# Altium project volumetric-display-boards.PrjPcb (part 1 of 2)
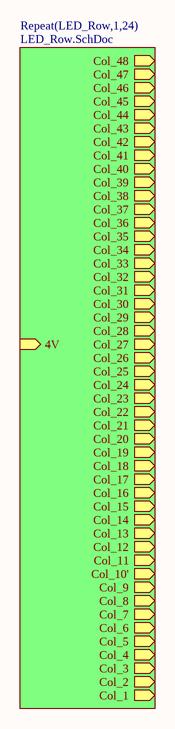
[diagram p0: LED_Matrix.SchDoc]
2 sheets, 384 parts. Net scope: hierarchical (ports join the sheet entries above them; power ports are global).
Board file: LED_Matrix.PcbDoc
Sheets:
  LED_Matrix.SchDoc
    LED_Row1 = LED_Row.SchDoc
    LED_Row2 = LED_Row.SchDoc
    LED_Row3 = LED_Row.SchDoc
    LED_Row4 = LED_Row.SchDoc
    LED_Row5 = LED_Row.SchDoc
    LED_Row6 = LED_Row.SchDoc
    LED_Row7 = LED_Row.SchDoc
    LED_Row8 = LED_Row.SchDoc
    LED_Row9 = LED_Row.SchDoc
    LED_Row10 = LED_Row.SchDoc
    LED_Row11 = LED_Row.SchDoc
    LED_Row12 = LED_Row.SchDoc
    LED_Row13 = LED_Row.SchDoc
    LED_Row14 = LED_Row.SchDoc
    LED_Row15 = LED_Row.SchDoc
    LED_Row16 = LED_Row.SchDoc
    LED_Row17 = LED_Row.SchDoc
    LED_Row18 = LED_Row.SchDoc
    LED_Row19 = LED_Row.SchDoc
    LED_Row20 = LED_Row.SchDoc
    LED_Row21 = LED_Row.SchDoc
    LED_Row22 = LED_Row.SchDoc
    LED_Row23 = LED_Row.SchDoc
    LED_Row24 = LED_Row.SchDoc

## Sheet LED_Matrix.SchDoc
size A; SheetNumber: 1; SheetTotal: 1

### Sub-sheets
Repeat(LED_Row,1,24) = LED_Row.SchDoc: Col_48 (out), Col_47 (out), Col_46 (out), Col_45 (out), Col_44 (out), Col_43 (out), Col_42 (out), Col_41 (out), Col_40 (out), Col_39 (out), Col_38 (out), Col_37 (out), Col_36 (out), Col_35 (out), Col_34 (out), Col_33 (out), Col_32 (out), Col_31 (out), Col_30 (out), Col_29 (out), Col_28 (out), Col_27 (out), Col_26 (out), Col_25 (out), Col_24 (out), Col_23 (out), Col_22 (out), Col_21 (out), Col_20 (out), Col_19 (out), Col_18 (out), Col_17 (out), Col_16 (out), Col_15 (out), Col_14 (out), Col_13 (out), Col_12 (out), Col_11 (out), Col_10' (out), Col_9 (out), Col_8 (out), Col_7 (out), Col_6 (out), Col_5 (out), Col_4 (out), Col_3 (out), Col_2 (out), Col_1 (out), 4V (in)

## Sheet LED_Row.SchDoc
size 549 x 199 mm; SheetNumber: 2; SheetTotal: 2
Used 24 times, as channels LED_Row1, LED_Row2, LED_Row3, LED_Row4, LED_Row5, LED_Row6, LED_Row7, LED_Row8, LED_Row9, LED_Row10, LED_Row11, LED_Row12, LED_Row13, LED_Row14, LED_Row15, LED_Row16, LED_Row17, LED_Row18, LED_Row19, LED_Row20, LED_Row21, LED_Row22, LED_Row23, LED_Row24. Parts and nets are listed once, with the designators drawn on the sheet.
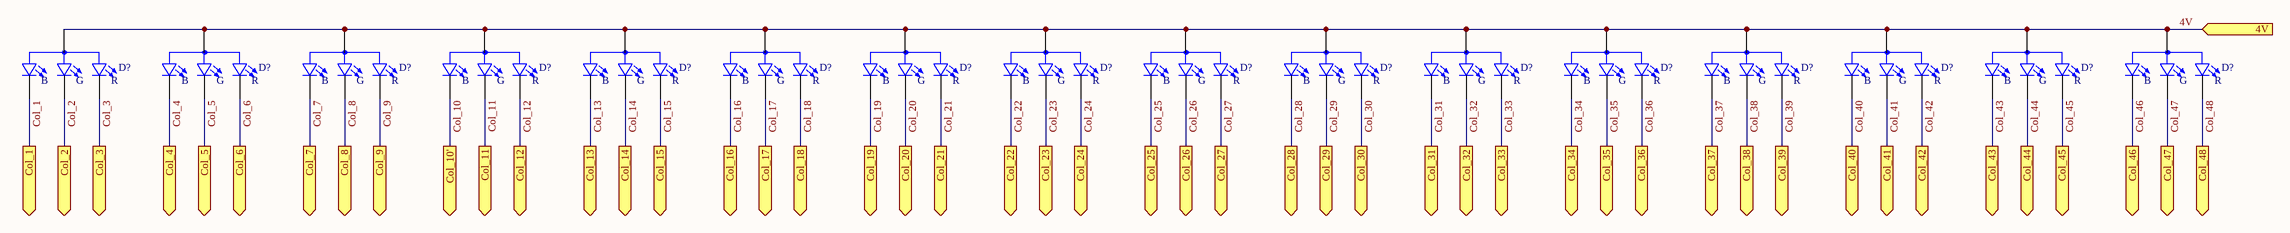
[diagram p1: LED_Row.SchDoc]

### Parts
(Parts that share a designator on the sheet are numbered #1, #2 ... from top to bottom, then left to right.)
D?#1  LED-RGB-0000  [LED-RGB-0000]  (value not drawn)
D?#2  LED-RGB-0000  [LED-RGB-0000]  (value not drawn)
D?#3  LED-RGB-0000  [LED-RGB-0000]  (value not drawn)
D?#4  LED-RGB-0000  [LED-RGB-0000]  (value not drawn)
D?#5  LED-RGB-0000  [LED-RGB-0000]  (value not drawn)
D?#6  LED-RGB-0000  [LED-RGB-0000]  (value not drawn)
D?#7  LED-RGB-0000  [LED-RGB-0000]  (value not drawn)
D?#8  LED-RGB-0000  [LED-RGB-0000]  (value not drawn)
D?#9  LED-RGB-0000  [LED-RGB-0000]  (value not drawn)
D?#10  LED-RGB-0000  [LED-RGB-0000]  (value not drawn)
D?#11  LED-RGB-0000  [LED-RGB-0000]  (value not drawn)
D?#12  LED-RGB-0000  [LED-RGB-0000]  (value not drawn)
D?#13  LED-RGB-0000  [LED-RGB-0000]  (value not drawn)
D?#14  LED-RGB-0000  [LED-RGB-0000]  (value not drawn)
D?#15  LED-RGB-0000  [LED-RGB-0000]  (value not drawn)
D?#16  LED-RGB-0000  [LED-RGB-0000]  (value not drawn)

### Ports
4V (in), Col_1 (out), Col_2 (out), Col_3 (out), Col_4 (out), Col_5 (out), Col_6 (out), Col_7 (out), Col_8 (out), Col_9 (out), Col_10' (out), Col_11 (out), Col_12 (out), Col_13 (out), Col_14 (out), Col_15 (out), Col_16 (out), Col_17 (out), Col_18 (out), Col_19 (out), Col_20 (out), Col_21 (out), Col_22 (out), Col_23 (out), Col_24 (out), Col_25 (out), Col_26 (out), Col_27 (out), Col_28 (out), Col_29 (out), Col_30 (out), Col_31 (out), Col_32 (out), Col_33 (out), Col_34 (out), Col_35 (out), Col_36 (out), Col_37 (out), Col_38 (out), Col_39 (out), Col_40 (out), Col_41 (out), Col_42 (out), Col_43 (out), Col_44 (out), Col_45 (out), Col_46 (out), Col_47 (out), Col_48 (out)

### Nets
4V: D?#1.3(A) D?#2.3(A) D?#3.3(A) D?#4.3(A) D?#5.3(A) D?#6.3(A) D?#7.3(A) D?#8.3(A) D?#9.3(A) D?#10.3(A) D?#11.3(A) D?#12.3(A) D?#13.3(A) D?#14.3(A) D?#15.3(A) D?#16.3(A) ; port 4V
Col_1: D?#1.2(B_C) ; port Col_1
Col_2: D?#1.1(G_C) ; port Col_2
Col_3: D?#1.4(R_C) ; port Col_3
Col_4: D?#2.2(B_C) ; port Col_4
Col_5: D?#2.1(G_C) ; port Col_5
Col_6: D?#2.4(R_C) ; port Col_6
Col_7: D?#3.2(B_C) ; port Col_7
Col_8: D?#3.1(G_C) ; port Col_8
Col_9: D?#3.4(R_C) ; port Col_9
Col_10: D?#4.2(B_C) ; port Col_10'
Col_11: D?#4.1(G_C) ; port Col_11
Col_12: D?#4.4(R_C) ; port Col_12
Col_13: D?#5.2(B_C) ; port Col_13
Col_14: D?#5.1(G_C) ; port Col_14
Col_15: D?#5.4(R_C) ; port Col_15
Col_16: D?#6.2(B_C) ; port Col_16
Col_17: D?#6.1(G_C) ; port Col_17
Col_18: D?#6.4(R_C) ; port Col_18
Col_19: D?#7.2(B_C) ; port Col_19
Col_20: D?#7.1(G_C) ; port Col_20
Col_21: D?#7.4(R_C) ; port Col_21
Col_22: D?#8.2(B_C) ; port Col_22
Col_23: D?#8.1(G_C) ; port Col_23
Col_24: D?#8.4(R_C) ; port Col_24
Col_25: D?#9.2(B_C) ; port Col_25
Col_26: D?#9.1(G_C) ; port Col_26
Col_27: D?#9.4(R_C) ; port Col_27
Col_28: D?#10.2(B_C) ; port Col_28
Col_29: D?#10.1(G_C) ; port Col_29
Col_30: D?#10.4(R_C) ; port Col_30
Col_31: D?#11.2(B_C) ; port Col_31
Col_32: D?#11.1(G_C) ; port Col_32
Col_33: D?#11.4(R_C) ; port Col_33
Col_34: D?#12.2(B_C) ; port Col_34
Col_35: D?#12.1(G_C) ; port Col_35
Col_36: D?#12.4(R_C) ; port Col_36
Col_37: D?#13.2(B_C) ; port Col_37
Col_38: D?#13.1(G_C) ; port Col_38
Col_39: D?#13.4(R_C) ; port Col_39
Col_40: D?#14.2(B_C) ; port Col_40
Col_41: D?#14.1(G_C) ; port Col_41
Col_42: D?#14.4(R_C) ; port Col_42
Col_43: D?#15.2(B_C) ; port Col_43
Col_44: D?#15.1(G_C) ; port Col_44
Col_45: D?#15.4(R_C) ; port Col_45
Col_46: D?#16.2(B_C) ; port Col_46
Col_47: D?#16.1(G_C) ; port Col_47
Col_48: D?#16.4(R_C) ; port Col_48

### Channels
LED_Row1: designators D?=D1_LED_Row1 D?=D2_LED_Row1 D?=D3_LED_Row1 D?=D4_LED_Row1 D?=D5_LED_Row1 D?=D6_LED_Row1 D?=D7_LED_Row1 D?=D8_LED_Row1 D?=D9_LED_Row1 D?=D10_LED_Row1 D?=D11_LED_Row1 D?=D12_LED_Row1 D?=D13_LED_Row1 D?=D14_LED_Row1 D?=D15_LED_Row1 D?=D16_LED_Row1; ports 4V=4V Col_1=Col_1 Col_2=Col_2 Col_3=Col_3 Col_4=Col_4 Col_5=Col_5 Col_6=Col_6 Col_7=Col_7 Col_8=Col_8 Col_9=Col_9 Col_10'=Col_10 Col_11=Col_11 Col_12=Col_12 Col_13=Col_13 Col_14=Col_14 Col_15=Col_15 Col_16=Col_16 Col_17=Col_17 Col_18=Col_18 Col_19=Col_19 Col_20=Col_20 Col_21=Col_21 Col_22=Col_22 Col_23=Col_23 Col_24=Col_24 Col_25=Col_25 Col_26=Col_26 Col_27=Col_27 Col_28=Col_28 Col_29=Col_29 Col_30=Col_30 Col_31=Col_31 Col_32=Col_32 Col_33=Col_33 Col_34=Col_34 Col_35=Col_35 Col_36=Col_36 Col_37=Col_37 Col_38=Col_38 Col_39=Col_39 Col_40=Col_40 Col_41=Col_41 Col_42=Col_42 Col_43=Col_43 Col_44=Col_44 Col_45=Col_45 Col_46=Col_46 Col_47=Col_47 Col_48=Col_48
LED_Row2: designators D?=D1_LED_Row2 D?=D2_LED_Row2 D?=D3_LED_Row2 D?=D4_LED_Row2 D?=D5_LED_Row2 D?=D6_LED_Row2 D?=D7_LED_Row2 D?=D8_LED_Row2 D?=D9_LED_Row2 D?=D10_LED_Row2 D?=D11_LED_Row2 D?=D12_LED_Row2 D?=D13_LED_Row2 D?=D14_LED_Row2 D?=D15_LED_Row2 D?=D16_LED_Row2; ports 4V=4V Col_1=Col_1 Col_2=Col_2 Col_3=Col_3 Col_4=Col_4 Col_5=Col_5 Col_6=Col_6 Col_7=Col_7 Col_8=Col_8 Col_9=Col_9 Col_10'=Col_10 Col_11=Col_11 Col_12=Col_12 Col_13=Col_13 Col_14=Col_14 Col_15=Col_15 Col_16=Col_16 Col_17=Col_17 Col_18=Col_18 Col_19=Col_19 Col_20=Col_20 Col_21=Col_21 Col_22=Col_22 Col_23=Col_23 Col_24=Col_24 Col_25=Col_25 Col_26=Col_26 Col_27=Col_27 Col_28=Col_28 Col_29=Col_29 Col_30=Col_30 Col_31=Col_31 Col_32=Col_32 Col_33=Col_33 Col_34=Col_34 Col_35=Col_35 Col_36=Col_36 Col_37=Col_37 Col_38=Col_38 Col_39=Col_39 Col_40=Col_40 Col_41=Col_41 Col_42=Col_42 Col_43=Col_43 Col_44=Col_44 Col_45=Col_45 Col_46=Col_46 Col_47=Col_47 Col_48=Col_48
LED_Row3: designators D?=D1_LED_Row3 D?=D2_LED_Row3 D?=D3_LED_Row3 D?=D4_LED_Row3 D?=D5_LED_Row3 D?=D6_LED_Row3 D?=D7_LED_Row3 D?=D8_LED_Row3 D?=D9_LED_Row3 D?=D10_LED_Row3 D?=D11_LED_Row3 D?=D12_LED_Row3 D?=D13_LED_Row3 D?=D14_LED_Row3 D?=D15_LED_Row3 D?=D16_LED_Row3; ports 4V=4V Col_1=Col_1 Col_2=Col_2 Col_3=Col_3 Col_4=Col_4 Col_5=Col_5 Col_6=Col_6 Col_7=Col_7 Col_8=Col_8 Col_9=Col_9 Col_10'=Col_10 Col_11=Col_11 Col_12=Col_12 Col_13=Col_13 Col_14=Col_14 Col_15=Col_15 Col_16=Col_16 Col_17=Col_17 Col_18=Col_18 Col_19=Col_19 Col_20=Col_20 Col_21=Col_21 Col_22=Col_22 Col_23=Col_23 Col_24=Col_24 Col_25=Col_25 Col_26=Col_26 Col_27=Col_27 Col_28=Col_28 Col_29=Col_29 Col_30=Col_30 Col_31=Col_31 Col_32=Col_32 Col_33=Col_33 Col_34=Col_34 Col_35=Col_35 Col_36=Col_36 Col_37=Col_37 Col_38=Col_38 Col_39=Col_39 Col_40=Col_40 Col_41=Col_41 Col_42=Col_42 Col_43=Col_43 Col_44=Col_44 Col_45=Col_45 Col_46=Col_46 Col_47=Col_47 Col_48=Col_48
LED_Row4: designators D?=D1_LED_Row4 D?=D2_LED_Row4 D?=D3_LED_Row4 D?=D4_LED_Row4 D?=D5_LED_Row4 D?=D6_LED_Row4 D?=D7_LED_Row4 D?=D8_LED_Row4 D?=D9_LED_Row4 D?=D10_LED_Row4 D?=D11_LED_Row4 D?=D12_LED_Row4 D?=D13_LED_Row4 D?=D14_LED_Row4 D?=D15_LED_Row4 D?=D16_LED_Row4; ports 4V=4V Col_1=Col_1 Col_2=Col_2 Col_3=Col_3 Col_4=Col_4 Col_5=Col_5 Col_6=Col_6 Col_7=Col_7 Col_8=Col_8 Col_9=Col_9 Col_10'=Col_10 Col_11=Col_11 Col_12=Col_12 Col_13=Col_13 Col_14=Col_14 Col_15=Col_15 Col_16=Col_16 Col_17=Col_17 Col_18=Col_18 Col_19=Col_19 Col_20=Col_20 Col_21=Col_21 Col_22=Col_22 Col_23=Col_23 Col_24=Col_24 Col_25=Col_25 Col_26=Col_26 Col_27=Col_27 Col_28=Col_28 Col_29=Col_29 Col_30=Col_30 Col_31=Col_31 Col_32=Col_32 Col_33=Col_33 Col_34=Col_34 Col_35=Col_35 Col_36=Col_36 Col_37=Col_37 Col_38=Col_38 Col_39=Col_39 Col_40=Col_40 Col_41=Col_41 Col_42=Col_42 Col_43=Col_43 Col_44=Col_44 Col_45=Col_45 Col_46=Col_46 Col_47=Col_47 Col_48=Col_48
LED_Row5: designators D?=D1_LED_Row5 D?=D2_LED_Row5 D?=D3_LED_Row5 D?=D4_LED_Row5 D?=D5_LED_Row5 D?=D6_LED_Row5 D?=D7_LED_Row5 D?=D8_LED_Row5 D?=D9_LED_Row5 D?=D10_LED_Row5 D?=D11_LED_Row5 D?=D12_LED_Row5 D?=D13_LED_Row5 D?=D14_LED_Row5 D?=D15_LED_Row5 D?=D16_LED_Row5; ports 4V=4V Col_1=Col_1 Col_2=Col_2 Col_3=Col_3 Col_4=Col_4 Col_5=Col_5 Col_6=Col_6 Col_7=Col_7 Col_8=Col_8 Col_9=Col_9 Col_10'=Col_10 Col_11=Col_11 Col_12=Col_12 Col_13=Col_13 Col_14=Col_14 Col_15=Col_15 Col_16=Col_16 Col_17=Col_17 Col_18=Col_18 Col_19=Col_19 Col_20=Col_20 Col_21=Col_21 Col_22=Col_22 Col_23=Col_23 Col_24=Col_24 Col_25=Col_25 Col_26=Col_26 Col_27=Col_27 Col_28=Col_28 Col_29=Col_29 Col_30=Col_30 Col_31=Col_31 Col_32=Col_32 Col_33=Col_33 Col_34=Col_34 Col_35=Col_35 Col_36=Col_36 Col_37=Col_37 Col_38=Col_38 Col_39=Col_39 Col_40=Col_40 Col_41=Col_41 Col_42=Col_42 Col_43=Col_43 Col_44=Col_44 Col_45=Col_45 Col_46=Col_46 Col_47=Col_47 Col_48=Col_48
LED_Row6: designators D?=D1_LED_Row6 D?=D2_LED_Row6 D?=D3_LED_Row6 D?=D4_LED_Row6 D?=D5_LED_Row6 D?=D6_LED_Row6 D?=D7_LED_Row6 D?=D8_LED_Row6 D?=D9_LED_Row6 D?=D10_LED_Row6 D?=D11_LED_Row6 D?=D12_LED_Row6 D?=D13_LED_Row6 D?=D14_LED_Row6 D?=D15_LED_Row6 D?=D16_LED_Row6; ports 4V=4V Col_1=Col_1 Col_2=Col_2 Col_3=Col_3 Col_4=Col_4 Col_5=Col_5 Col_6=Col_6 Col_7=Col_7 Col_8=Col_8 Col_9=Col_9 Col_10'=Col_10 Col_11=Col_11 Col_12=Col_12 Col_13=Col_13 Col_14=Col_14 Col_15=Col_15 Col_16=Col_16 Col_17=Col_17 Col_18=Col_18 Col_19=Col_19 Col_20=Col_20 Col_21=Col_21 Col_22=Col_22 Col_23=Col_23 Col_24=Col_24 Col_25=Col_25 Col_26=Col_26 Col_27=Col_27 Col_28=Col_28 Col_29=Col_29 Col_30=Col_30 Col_31=Col_31 Col_32=Col_32 Col_33=Col_33 Col_34=Col_34 Col_35=Col_35 Col_36=Col_36 Col_37=Col_37 Col_38=Col_38 Col_39=Col_39 Col_40=Col_40 Col_41=Col_41 Col_42=Col_42 Col_43=Col_43 Col_44=Col_44 Col_45=Col_45 Col_46=Col_46 Col_47=Col_47 Col_48=Col_48
LED_Row7: designators D?=D1_LED_Row7 D?=D2_LED_Row7 D?=D3_LED_Row7 D?=D4_LED_Row7 D?=D5_LED_Row7 D?=D6_LED_Row7 D?=D7_LED_Row7 D?=D8_LED_Row7 D?=D9_LED_Row7 D?=D10_LED_Row7 D?=D11_LED_Row7 D?=D12_LED_Row7 D?=D13_LED_Row7 D?=D14_LED_Row7 D?=D15_LED_Row7 D?=D16_LED_Row7; ports 4V=4V Col_1=Col_1 Col_2=Col_2 Col_3=Col_3 Col_4=Col_4 Col_5=Col_5 Col_6=Col_6 Col_7=Col_7 Col_8=Col_8 Col_9=Col_9 Col_10'=Col_10 Col_11=Col_11 Col_12=Col_12 Col_13=Col_13 Col_14=Col_14 Col_15=Col_15 Col_16=Col_16 Col_17=Col_17 Col_18=Col_18 Col_19=Col_19 Col_20=Col_20 Col_21=Col_21 Col_22=Col_22 Col_23=Col_23 Col_24=Col_24 Col_25=Col_25 Col_26=Col_26 Col_27=Col_27 Col_28=Col_28 Col_29=Col_29 Col_30=Col_30 Col_31=Col_31 Col_32=Col_32 Col_33=Col_33 Col_34=Col_34 Col_35=Col_35 Col_36=Col_36 Col_37=Col_37 Col_38=Col_38 Col_39=Col_39 Col_40=Col_40 Col_41=Col_41 Col_42=Col_42 Col_43=Col_43 Col_44=Col_44 Col_45=Col_45 Col_46=Col_46 Col_47=Col_47 Col_48=Col_48
LED_Row8: designators D?=D1_LED_Row8 D?=D2_LED_Row8 D?=D3_LED_Row8 D?=D4_LED_Row8 D?=D5_LED_Row8 D?=D6_LED_Row8 D?=D7_LED_Row8 D?=D8_LED_Row8 D?=D9_LED_Row8 D?=D10_LED_Row8 D?=D11_LED_Row8 D?=D12_LED_Row8 D?=D13_LED_Row8 D?=D14_LED_Row8 D?=D15_LED_Row8 D?=D16_LED_Row8; ports 4V=4V Col_1=Col_1 Col_2=Col_2 Col_3=Col_3 Col_4=Col_4 Col_5=Col_5 Col_6=Col_6 Col_7=Col_7 Col_8=Col_8 Col_9=Col_9 Col_10'=Col_10 Col_11=Col_11 Col_12=Col_12 Col_13=Col_13 Col_14=Col_14 Col_15=Col_15 Col_16=Col_16 Col_17=Col_17 Col_18=Col_18 Col_19=Col_19 Col_20=Col_20 Col_21=Col_21 Col_22=Col_22 Col_23=Col_23 Col_24=Col_24 Col_25=Col_25 Col_26=Col_26 Col_27=Col_27 Col_28=Col_28 Col_29=Col_29 Col_30=Col_30 Col_31=Col_31 Col_32=Col_32 Col_33=Col_33 Col_34=Col_34 Col_35=Col_35 Col_36=Col_36 Col_37=Col_37 Col_38=Col_38 Col_39=Col_39 Col_40=Col_40 Col_41=Col_41 Col_42=Col_42 Col_43=Col_43 Col_44=Col_44 Col_45=Col_45 Col_46=Col_46 Col_47=Col_47 Col_48=Col_48
LED_Row9: designators D?=D1_LED_Row9 D?=D2_LED_Row9 D?=D3_LED_Row9 D?=D4_LED_Row9 D?=D5_LED_Row9 D?=D6_LED_Row9 D?=D7_LED_Row9 D?=D8_LED_Row9 D?=D9_LED_Row9 D?=D10_LED_Row9 D?=D11_LED_Row9 D?=D12_LED_Row9 D?=D13_LED_Row9 D?=D14_LED_Row9 D?=D15_LED_Row9 D?=D16_LED_Row9; ports 4V=4V Col_1=Col_1 Col_2=Col_2 Col_3=Col_3 Col_4=Col_4 Col_5=Col_5 Col_6=Col_6 Col_7=Col_7 Col_8=Col_8 Col_9=Col_9 Col_10'=Col_10 Col_11=Col_11 Col_12=Col_12 Col_13=Col_13 Col_14=Col_14 Col_15=Col_15 Col_16=Col_16 Col_17=Col_17 Col_18=Col_18 Col_19=Col_19 Col_20=Col_20 Col_21=Col_21 Col_22=Col_22 Col_23=Col_23 Col_24=Col_24 Col_25=Col_25 Col_26=Col_26 Col_27=Col_27 Col_28=Col_28 Col_29=Col_29 Col_30=Col_30 Col_31=Col_31 Col_32=Col_32 Col_33=Col_33 Col_34=Col_34 Col_35=Col_35 Col_36=Col_36 Col_37=Col_37 Col_38=Col_38 Col_39=Col_39 Col_40=Col_40 Col_41=Col_41 Col_42=Col_42 Col_43=Col_43 Col_44=Col_44 Col_45=Col_45 Col_46=Col_46 Col_47=Col_47 Col_48=Col_48
LED_Row10: designators D?=D1_LED_Row10 D?=D2_LED_Row10 D?=D3_LED_Row10 D?=D4_LED_Row10 D?=D5_LED_Row10 D?=D6_LED_Row10 D?=D7_LED_Row10 D?=D8_LED_Row10 D?=D9_LED_Row10 D?=D10_LED_Row10 D?=D11_LED_Row10 D?=D12_LED_Row10 D?=D13_LED_Row10 D?=D14_LED_Row10 D?=D15_LED_Row10 D?=D16_LED_Row10; ports 4V=4V Col_1=Col_1 Col_2=Col_2 Col_3=Col_3 Col_4=Col_4 Col_5=Col_5 Col_6=Col_6 Col_7=Col_7 Col_8=Col_8 Col_9=Col_9 Col_10'=Col_10 Col_11=Col_11 Col_12=Col_12 Col_13=Col_13 Col_14=Col_14 Col_15=Col_15 Col_16=Col_16 Col_17=Col_17 Col_18=Col_18 Col_19=Col_19 Col_20=Col_20 Col_21=Col_21 Col_22=Col_22 Col_23=Col_23 Col_24=Col_24 Col_25=Col_25 Col_26=Col_26 Col_27=Col_27 Col_28=Col_28 Col_29=Col_29 Col_30=Col_30 Col_31=Col_31 Col_32=Col_32 Col_33=Col_33 Col_34=Col_34 Col_35=Col_35 Col_36=Col_36 Col_37=Col_37 Col_38=Col_38 Col_39=Col_39 Col_40=Col_40 Col_41=Col_41 Col_42=Col_42 Col_43=Col_43 Col_44=Col_44 Col_45=Col_45 Col_46=Col_46 Col_47=Col_47 Col_48=Col_48
LED_Row11: designators D?=D1_LED_Row11 D?=D2_LED_Row11 D?=D3_LED_Row11 D?=D4_LED_Row11 D?=D5_LED_Row11 D?=D6_LED_Row11 D?=D7_LED_Row11 D?=D8_LED_Row11 D?=D9_LED_Row11 D?=D10_LED_Row11 D?=D11_LED_Row11 D?=D12_LED_Row11 D?=D13_LED_Row11 D?=D14_LED_Row11 D?=D15_LED_Row11 D?=D16_LED_Row11; ports 4V=4V Col_1=Col_1 Col_2=Col_2 Col_3=Col_3 Col_4=Col_4 Col_5=Col_5 Col_6=Col_6 Col_7=Col_7 Col_8=Col_8 Col_9=Col_9 Col_10'=Col_10 Col_11=Col_11 Col_12=Col_12 Col_13=Col_13 Col_14=Col_14 Col_15=Col_15 Col_16=Col_16 Col_17=Col_17 Col_18=Col_18 Col_19=Col_19 Col_20=Col_20 Col_21=Col_21 Col_22=Col_22 Col_23=Col_23 Col_24=Col_24 Col_25=Col_25 Col_26=Col_26 Col_27=Col_27 Col_28=Col_28 Col_29=Col_29 Col_30=Col_30 Col_31=Col_31 Col_32=Col_32 Col_33=Col_33 Col_34=Col_34 Col_35=Col_35 Col_36=Col_36 Col_37=Col_37 Col_38=Col_38 Col_39=Col_39 Col_40=Col_40 Col_41=Col_41 Col_42=Col_42 Col_43=Col_43 Col_44=Col_44 Col_45=Col_45 Col_46=Col_46 Col_47=Col_47 Col_48=Col_48
LED_Row12: designators D?=D1_LED_Row12 D?=D2_LED_Row12 D?=D3_LED_Row12 D?=D4_LED_Row12 D?=D5_LED_Row12 D?=D6_LED_Row12 D?=D7_LED_Row12 D?=D8_LED_Row12 D?=D9_LED_Row12 D?=D10_LED_Row12 D?=D11_LED_Row12 D?=D12_LED_Row12 D?=D13_LED_Row12 D?=D14_LED_Row12 D?=D15_LED_Row12 D?=D16_LED_Row12; ports 4V=4V Col_1=Col_1 Col_2=Col_2 Col_3=Col_3 Col_4=Col_4 Col_5=Col_5 Col_6=Col_6 Col_7=Col_7 Col_8=Col_8 Col_9=Col_9 Col_10'=Col_10 Col_11=Col_11 Col_12=Col_12 Col_13=Col_13 Col_14=Col_14 Col_15=Col_15 Col_16=Col_16 Col_17=Col_17 Col_18=Col_18 Col_19=Col_19 Col_20=Col_20 Col_21=Col_21 Col_22=Col_22 Col_23=Col_23 Col_24=Col_24 Col_25=Col_25 Col_26=Col_26 Col_27=Col_27 Col_28=Col_28 Col_29=Col_29 Col_30=Col_30 Col_31=Col_31 Col_32=Col_32 Col_33=Col_33 Col_34=Col_34 Col_35=Col_35 Col_36=Col_36 Col_37=Col_37 Col_38=Col_38 Col_39=Col_39 Col_40=Col_40 Col_41=Col_41 Col_42=Col_42 Col_43=Col_43 Col_44=Col_44 Col_45=Col_45 Col_46=Col_46 Col_47=Col_47 Col_48=Col_48
LED_Row13: designators D?=D1_LED_Row13 D?=D2_LED_Row13 D?=D3_LED_Row13 D?=D4_LED_Row13 D?=D5_LED_Row13 D?=D6_LED_Row13 D?=D7_LED_Row13 D?=D8_LED_Row13 D?=D9_LED_Row13 D?=D10_LED_Row13 D?=D11_LED_Row13 D?=D12_LED_Row13 D?=D13_LED_Row13 D?=D14_LED_Row13 D?=D15_LED_Row13 D?=D16_LED_Row13; ports 4V=4V Col_1=Col_1 Col_2=Col_2 Col_3=Col_3 Col_4=Col_4 Col_5=Col_5 Col_6=Col_6 Col_7=Col_7 Col_8=Col_8 Col_9=Col_9 Col_10'=Col_10 Col_11=Col_11 Col_12=Col_12 Col_13=Col_13 Col_14=Col_14 Col_15=Col_15 Col_16=Col_16 Col_17=Col_17 Col_18=Col_18 Col_19=Col_19 Col_20=Col_20 Col_21=Col_21 Col_22=Col_22 Col_23=Col_23 Col_24=Col_24 Col_25=Col_25 Col_26=Col_26 Col_27=Col_27 Col_28=Col_28 Col_29=Col_29 Col_30=Col_30 Col_31=Col_31 Col_32=Col_32 Col_33=Col_33 Col_34=Col_34 Col_35=Col_35 Col_36=Col_36 Col_37=Col_37 Col_38=Col_38 Col_39=Col_39 Col_40=Col_40 Col_41=Col_41 Col_42=Col_42 Col_43=Col_43 Col_44=Col_44 Col_45=Col_45 Col_46=Col_46 Col_47=Col_47 Col_48=Col_48
LED_Row14: designators D?=D1_LED_Row14 D?=D2_LED_Row14 D?=D3_LED_Row14 D?=D4_LED_Row14 D?=D5_LED_Row14 D?=D6_LED_Row14 D?=D7_LED_Row14 D?=D8_LED_Row14 D?=D9_LED_Row14 D?=D10_LED_Row14 D?=D11_LED_Row14 D?=D12_LED_Row14 D?=D13_LED_Row14 D?=D14_LED_Row14 D?=D15_LED_Row14 D?=D16_LED_Row14; ports 4V=4V Col_1=Col_1 Col_2=Col_2 Col_3=Col_3 Col_4=Col_4 Col_5=Col_5 Col_6=Col_6 Col_7=Col_7 Col_8=Col_8 Col_9=Col_9 Col_10'=Col_10 Col_11=Col_11 Col_12=Col_12 Col_13=Col_13 Col_14=Col_14 Col_15=Col_15 Col_16=Col_16 Col_17=Col_17 Col_18=Col_18 Col_19=Col_19 Col_20=Col_20 Col_21=Col_21 Col_22=Col_22 Col_23=Col_23 Col_24=Col_24 Col_25=Col_25 Col_26=Col_26 Col_27=Col_27 Col_28=Col_28 Col_29=Col_29 Col_30=Col_30 Col_31=Col_31 Col_32=Col_32 Col_33=Col_33 Col_34=Col_34 Col_35=Col_35 Col_36=Col_36 Col_37=Col_37 Col_38=Col_38 Col_39=Col_39 Col_40=Col_40 Col_41=Col_41 Col_42=Col_42 Col_43=Col_43 Col_44=Col_44 Col_45=Col_45 Col_46=Col_46 Col_47=Col_47 Col_48=Col_48
LED_Row15: designators D?=D1_LED_Row15 D?=D2_LED_Row15 D?=D3_LED_Row15 D?=D4_LED_Row15 D?=D5_LED_Row15 D?=D6_LED_Row15 D?=D7_LED_Row15 D?=D8_LED_Row15 D?=D9_LED_Row15 D?=D10_LED_Row15 D?=D11_LED_Row15 D?=D12_LED_Row15 D?=D13_LED_Row15 D?=D14_LED_Row15 D?=D15_LED_Row15 D?=D16_LED_Row15; ports 4V=4V Col_1=Col_1 Col_2=Col_2 Col_3=Col_3 Col_4=Col_4 Col_5=Col_5 Col_6=Col_6 Col_7=Col_7 Col_8=Col_8 Col_9=Col_9 Col_10'=Col_10 Col_11=Col_11 Col_12=Col_12 Col_13=Col_13 Col_14=Col_14 Col_15=Col_15 Col_16=Col_16 Col_17=Col_17 Col_18=Col_18 Col_19=Col_19 Col_20=Col_20 Col_21=Col_21 Col_22=Col_22 Col_23=Col_23 Col_24=Col_24 Col_25=Col_25 Col_26=Col_26 Col_27=Col_27 Col_28=Col_28 Col_29=Col_29 Col_30=Col_30 Col_31=Col_31 Col_32=Col_32 Col_33=Col_33 Col_34=Col_34 Col_35=Col_35 Col_36=Col_36 Col_37=Col_37 Col_38=Col_38 Col_39=Col_39 Col_40=Col_40 Col_41=Col_41 Col_42=Col_42 Col_43=Col_43 Col_44=Col_44 Col_45=Col_45 Col_46=Col_46 Col_47=Col_47 Col_48=Col_48
LED_Row16: designators D?=D1_LED_Row16 D?=D2_LED_Row16 D?=D3_LED_Row16 D?=D4_LED_Row16 D?=D5_LED_Row16 D?=D6_LED_Row16 D?=D7_LED_Row16 D?=D8_LED_Row16 D?=D9_LED_Row16 D?=D10_LED_Row16 D?=D11_LED_Row16 D?=D12_LED_Row16 D?=D13_LED_Row16 D?=D14_LED_Row16 D?=D15_LED_Row16 D?=D16_LED_Row16; ports 4V=4V Col_1=Col_1 Col_2=Col_2 Col_3=Col_3 Col_4=Col_4 Col_5=Col_5 Col_6=Col_6 Col_7=Col_7 Col_8=Col_8 Col_9=Col_9 Col_10'=Col_10 Col_11=Col_11 Col_12=Col_12 Col_13=Col_13 Col_14=Col_14 Col_15=Col_15 Col_16=Col_16 Col_17=Col_17 Col_18=Col_18 Col_19=Col_19 Col_20=Col_20 Col_21=Col_21 Col_22=Col_22 Col_23=Col_23 Col_24=Col_24 Col_25=Col_25 Col_26=Col_26 Col_27=Col_27 Col_28=Col_28 Col_29=Col_29 Col_30=Col_30 Col_31=Col_31 Col_32=Col_32 Col_33=Col_33 Col_34=Col_34 Col_35=Col_35 Col_36=Col_36 Col_37=Col_37 Col_38=Col_38 Col_39=Col_39 Col_40=Col_40 Col_41=Col_41 Col_42=Col_42 Col_43=Col_43 Col_44=Col_44 Col_45=Col_45 Col_46=Col_46 Col_47=Col_47 Col_48=Col_48
LED_Row17: designators D?=D1_LED_Row17 D?=D2_LED_Row17 D?=D3_LED_Row17 D?=D4_LED_Row17 D?=D5_LED_Row17 D?=D6_LED_Row17 D?=D7_LED_Row17 D?=D8_LED_Row17 D?=D9_LED_Row17 D?=D10_LED_Row17 D?=D11_LED_Row17 D?=D12_LED_Row17 D?=D13_LED_Row17 D?=D14_LED_Row17 D?=D15_LED_Row17 D?=D16_LED_Row17; ports 4V=4V Col_1=Col_1 Col_2=Col_2 Col_3=Col_3 Col_4=Col_4 Col_5=Col_5 Col_6=Col_6 Col_7=Col_7 Col_8=Col_8 Col_9=Col_9 Col_10'=Col_10 Col_11=Col_11 Col_12=Col_12 Col_13=Col_13 Col_14=Col_14 Col_15=Col_15 Col_16=Col_16 Col_17=Col_17 Col_18=Col_18 Col_19=Col_19 Col_20=Col_20 Col_21=Col_21 Col_22=Col_22 Col_23=Col_23 Col_24=Col_24 Col_25=Col_25 Col_26=Col_26 Col_27=Col_27 Col_28=Col_28 Col_29=Col_29 Col_30=Col_30 Col_31=Col_31 Col_32=Col_32 Col_33=Col_33 Col_34=Col_34 Col_35=Col_35 Col_36=Col_36 Col_37=Col_37 Col_38=Col_38 Col_39=Col_39 Col_40=Col_40 Col_41=Col_41 Col_42=Col_42 Col_43=Col_43 Col_44=Col_44 Col_45=Col_45 Col_46=Col_46 Col_47=Col_47 Col_48=Col_48
LED_Row18: designators D?=D1_LED_Row18 D?=D2_LED_Row18 D?=D3_LED_Row18 D?=D4_LED_Row18 D?=D5_LED_Row18 D?=D6_LED_Row18 D?=D7_LED_Row18 D?=D8_LED_Row18 D?=D9_LED_Row18 D?=D10_LED_Row18 D?=D11_LED_Row18 D?=D12_LED_Row18 D?=D13_LED_Row18 D?=D14_LED_Row18 D?=D15_LED_Row18 D?=D16_LED_Row18; ports 4V=4V Col_1=Col_1 Col_2=Col_2 Col_3=Col_3 Col_4=Col_4 Col_5=Col_5 Col_6=Col_6 Col_7=Col_7 Col_8=Col_8 Col_9=Col_9 Col_10'=Col_10 Col_11=Col_11 Col_12=Col_12 Col_13=Col_13 Col_14=Col_14 Col_15=Col_15 Col_16=Col_16 Col_17=Col_17 Col_18=Col_18 Col_19=Col_19 Col_20=Col_20 Col_21=Col_21 Col_22=Col_22 Col_23=Col_23 Col_24=Col_24 Col_25=Col_25 Col_26=Col_26 Col_27=Col_27 Col_28=Col_28 Col_29=Col_29 Col_30=Col_30 Col_31=Col_31 Col_32=Col_32 Col_33=Col_33 Col_34=Col_34 Col_35=Col_35 Col_36=Col_36 Col_37=Col_37 Col_38=Col_38 Col_39=Col_39 Col_40=Col_40 Col_41=Col_41 Col_42=Col_42 Col_43=Col_43 Col_44=Col_44 Col_45=Col_45 Col_46=Col_46 Col_47=Col_47 Col_48=Col_48
LED_Row19: designators D?=D1_LED_Row19 D?=D2_LED_Row19 D?=D3_LED_Row19 D?=D4_LED_Row19 D?=D5_LED_Row19 D?=D6_LED_Row19 D?=D7_LED_Row19 D?=D8_LED_Row19 D?=D9_LED_Row19 D?=D10_LED_Row19 D?=D11_LED_Row19 D?=D12_LED_Row19 D?=D13_LED_Row19 D?=D14_LED_Row19 D?=D15_LED_Row19 D?=D16_LED_Row19; ports 4V=4V Col_1=Col_1 Col_2=Col_2 Col_3=Col_3 Col_4=Col_4 Col_5=Col_5 Col_6=Col_6 Col_7=Col_7 Col_8=Col_8 Col_9=Col_9 Col_10'=Col_10 Col_11=Col_11 Col_12=Col_12 Col_13=Col_13 Col_14=Col_14 Col_15=Col_15 Col_16=Col_16 Col_17=Col_17 Col_18=Col_18 Col_19=Col_19 Col_20=Col_20 Col_21=Col_21 Col_22=Col_22 Col_23=Col_23 Col_24=Col_24 Col_25=Col_25 Col_26=Col_26 Col_27=Col_27 Col_28=Col_28 Col_29=Col_29 Col_30=Col_30 Col_31=Col_31 Col_32=Col_32 Col_33=Col_33 Col_34=Col_34 Col_35=Col_35 Col_36=Col_36 Col_37=Col_37 Col_38=Col_38 Col_39=Col_39 Col_40=Col_40 Col_41=Col_41 Col_42=Col_42 Col_43=Col_43 Col_44=Col_44 Col_45=Col_45 Col_46=Col_46 Col_47=Col_47 Col_48=Col_48
LED_Row20: designators D?=D1_LED_Row20 D?=D2_LED_Row20 D?=D3_LED_Row20 D?=D4_LED_Row20 D?=D5_LED_Row20 D?=D6_LED_Row20 D?=D7_LED_Row20 D?=D8_LED_Row20 D?=D9_LED_Row20 D?=D10_LED_Row20 D?=D11_LED_Row20 D?=D12_LED_Row20 D?=D13_LED_Row20 D?=D14_LED_Row20 D?=D15_LED_Row20 D?=D16_LED_Row20; ports 4V=4V Col_1=Col_1 Col_2=Col_2 Col_3=Col_3 Col_4=Col_4 Col_5=Col_5 Col_6=Col_6 Col_7=Col_7 Col_8=Col_8 Col_9=Col_9 Col_10'=Col_10 Col_11=Col_11 Col_12=Col_12 Col_13=Col_13 Col_14=Col_14 Col_15=Col_15 Col_16=Col_16 Col_17=Col_17 Col_18=Col_18 Col_19=Col_19 Col_20=Col_20 Col_21=Col_21 Col_22=Col_22 Col_23=Col_23 Col_24=Col_24 Col_25=Col_25 Col_26=Col_26 Col_27=Col_27 Col_28=Col_28 Col_29=Col_29 Col_30=Col_30 Col_31=Col_31 Col_32=Col_32 Col_33=Col_33 Col_34=Col_34 Col_35=Col_35 Col_36=Col_36 Col_37=Col_37 Col_38=Col_38 Col_39=Col_39 Col_40=Col_40 Col_41=Col_41 Col_42=Col_42 Col_43=Col_43 Col_44=Col_44 Col_45=Col_45 Col_46=Col_46 Col_47=Col_47 Col_48=Col_48
LED_Row21: designators D?=D1_LED_Row21 D?=D2_LED_Row21 D?=D3_LED_Row21 D?=D4_LED_Row21 D?=D5_LED_Row21 D?=D6_LED_Row21 D?=D7_LED_Row21 D?=D8_LED_Row21 D?=D9_LED_Row21 D?=D10_LED_Row21 D?=D11_LED_Row21 D?=D12_LED_Row21 D?=D13_LED_Row21 D?=D14_LED_Row21 D?=D15_LED_Row21 D?=D16_LED_Row21; ports 4V=4V Col_1=Col_1 Col_2=Col_2 Col_3=Col_3 Col_4=Col_4 Col_5=Col_5 Col_6=Col_6 Col_7=Col_7 Col_8=Col_8 Col_9=Col_9 Col_10'=Col_10 Col_11=Col_11 Col_12=Col_12 Col_13=Col_13 Col_14=Col_14 Col_15=Col_15 Col_16=Col_16 Col_17=Col_17 Col_18=Col_18 Col_19=Col_19 Col_20=Col_20 Col_21=Col_21 Col_22=Col_22 Col_23=Col_23 Col_24=Col_24 Col_25=Col_25 Col_26=Col_26 Col_27=Col_27 Col_28=Col_28 Col_29=Col_29 Col_30=Col_30 Col_31=Col_31 Col_32=Col_32 Col_33=Col_33 Col_34=Col_34 Col_35=Col_35 Col_36=Col_36 Col_37=Col_37 Col_38=Col_38 Col_39=Col_39 Col_40=Col_40 Col_41=Col_41 Col_42=Col_42 Col_43=Col_43 Col_44=Col_44 Col_45=Col_45 Col_46=Col_46 Col_47=Col_47 Col_48=Col_48
LED_Row22: designators D?=D1_LED_Row22 D?=D2_LED_Row22 D?=D3_LED_Row22 D?=D4_LED_Row22 D?=D5_LED_Row22 D?=D6_LED_Row22 D?=D7_LED_Row22 D?=D8_LED_Row22 D?=D9_LED_Row22 D?=D10_LED_Row22 D?=D11_LED_Row22 D?=D12_LED_Row22 D?=D13_LED_Row22 D?=D14_LED_Row22 D?=D15_LED_Row22 D?=D16_LED_Row22; ports 4V=4V Col_1=Col_1 Col_2=Col_2 Col_3=Col_3 Col_4=Col_4 Col_5=Col_5 Col_6=Col_6 Col_7=Col_7 Col_8=Col_8 Col_9=Col_9 Col_10'=Col_10 Col_11=Col_11 Col_12=Col_12 Col_13=Col_13 Col_14=Col_14 Col_15=Col_15 Col_16=Col_16 Col_17=Col_17 Col_18=Col_18 Col_19=Col_19 Col_20=Col_20 Col_21=Col_21 Col_22=Col_22 Col_23=Col_23 Col_24=Col_24 Col_25=Col_25 Col_26=Col_26 Col_27=Col_27 Col_28=Col_28 Col_29=Col_29 Col_30=Col_30 Col_31=Col_31 Col_32=Col_32 Col_33=Col_33 Col_34=Col_34 Col_35=Col_35 Col_36=Col_36 Col_37=Col_37 Col_38=Col_38 Col_39=Col_39 Col_40=Col_40 Col_41=Col_41 Col_42=Col_42 Col_43=Col_43 Col_44=Col_44 Col_45=Col_45 Col_46=Col_46 Col_47=Col_47 Col_48=Col_48
LED_Row23: designators D?=D1_LED_Row23 D?=D2_LED_Row23 D?=D3_LED_Row23 D?=D4_LED_Row23 D?=D5_LED_Row23 D?=D6_LED_Row23 D?=D7_LED_Row23 D?=D8_LED_Row23 D?=D9_LED_Row23 D?=D10_LED_Row23 D?=D11_LED_Row23 D?=D12_LED_Row23 D?=D13_LED_Row23 D?=D14_LED_Row23 D?=D15_LED_Row23 D?=D16_LED_Row23; ports 4V=4V Col_1=Col_1 Col_2=Col_2 Col_3=Col_3 Col_4=Col_4 Col_5=Col_5 Col_6=Col_6 Col_7=Col_7 Col_8=Col_8 Col_9=Col_9 Col_10'=Col_10 Col_11=Col_11 Col_12=Col_12 Col_13=Col_13 Col_14=Col_14 Col_15=Col_15 Col_16=Col_16 Col_17=Col_17 Col_18=Col_18 Col_19=Col_19 Col_20=Col_20 Col_21=Col_21 Col_22=Col_22 Col_23=Col_23 Col_24=Col_24 Col_25=Col_25 Col_26=Col_26 Col_27=Col_27 Col_28=Col_28 Col_29=Col_29 Col_30=Col_30 Col_31=Col_31 Col_32=Col_32 Col_33=Col_33 Col_34=Col_34 Col_35=Col_35 Col_36=Col_36 Col_37=Col_37 Col_38=Col_38 Col_39=Col_39 Col_40=Col_40 Col_41=Col_41 Col_42=Col_42 Col_43=Col_43 Col_44=Col_44 Col_45=Col_45 Col_46=Col_46 Col_47=Col_47 Col_48=Col_48
LED_Row24: designators D?=D1_LED_Row24 D?=D2_LED_Row24 D?=D3_LED_Row24 D?=D4_LED_Row24 D?=D5_LED_Row24 D?=D6_LED_Row24 D?=D7_LED_Row24 D?=D8_LED_Row24 D?=D9_LED_Row24 D?=D10_LED_Row24 D?=D11_LED_Row24 D?=D12_LED_Row24 D?=D13_LED_Row24 D?=D14_LED_Row24 D?=D15_LED_Row24 D?=D16_LED_Row24; ports 4V=4V Col_1=Col_1 Col_2=Col_2 Col_3=Col_3 Col_4=Col_4 Col_5=Col_5 Col_6=Col_6 Col_7=Col_7 Col_8=Col_8 Col_9=Col_9 Col_10'=Col_10 Col_11=Col_11 Col_12=Col_12 Col_13=Col_13 Col_14=Col_14 Col_15=Col_15 Col_16=Col_16 Col_17=Col_17 Col_18=Col_18 Col_19=Col_19 Col_20=Col_20 Col_21=Col_21 Col_22=Col_22 Col_23=Col_23 Col_24=Col_24 Col_25=Col_25 Col_26=Col_26 Col_27=Col_27 Col_28=Col_28 Col_29=Col_29 Col_30=Col_30 Col_31=Col_31 Col_32=Col_32 Col_33=Col_33 Col_34=Col_34 Col_35=Col_35 Col_36=Col_36 Col_37=Col_37 Col_38=Col_38 Col_39=Col_39 Col_40=Col_40 Col_41=Col_41 Col_42=Col_42 Col_43=Col_43 Col_44=Col_44 Col_45=Col_45 Col_46=Col_46 Col_47=Col_47 Col_48=Col_48

### Notes on the sheet
- (in symbol LED-RGB-0000) B; G; R

### Library data of the parts
D?#1-D?#16 = LED-RGB-0000: Red, Green, Blue (RGB) - LED Indication - Discrete 2V Red, 3V Green, 3V Blue 0606 (1616 Metric) / 10mA per LED channel; MF: Harvatek Corporation; MP: B38G3RGB-10D0003H2U1930; Price: None; Purchase-URL: https://pricing.snapeda.com/search/part/B38G3RGB-10D0003H2U1930/?ref=eda; SnapEDA_Link: https://www.snapeda.com/parts/B38G3RGB-10D0003H2U1930/Harvatek/view-part/?ref=snap; Availability: In Stock; Value: *; Package: None; Check_prices: https://www.snapeda.com/parts/B38G3RGB-10D0003H2U1930/Harvatek/view-part/?ref=eda; ComponentLink1Description: Datasheet; ComponentLink1URL: https://mm.digikey.com/Volume0/opasdata/d220001/medias/docus/2486/B38G3RGB-10D0003H2U1930%20%20V1.9.pdf